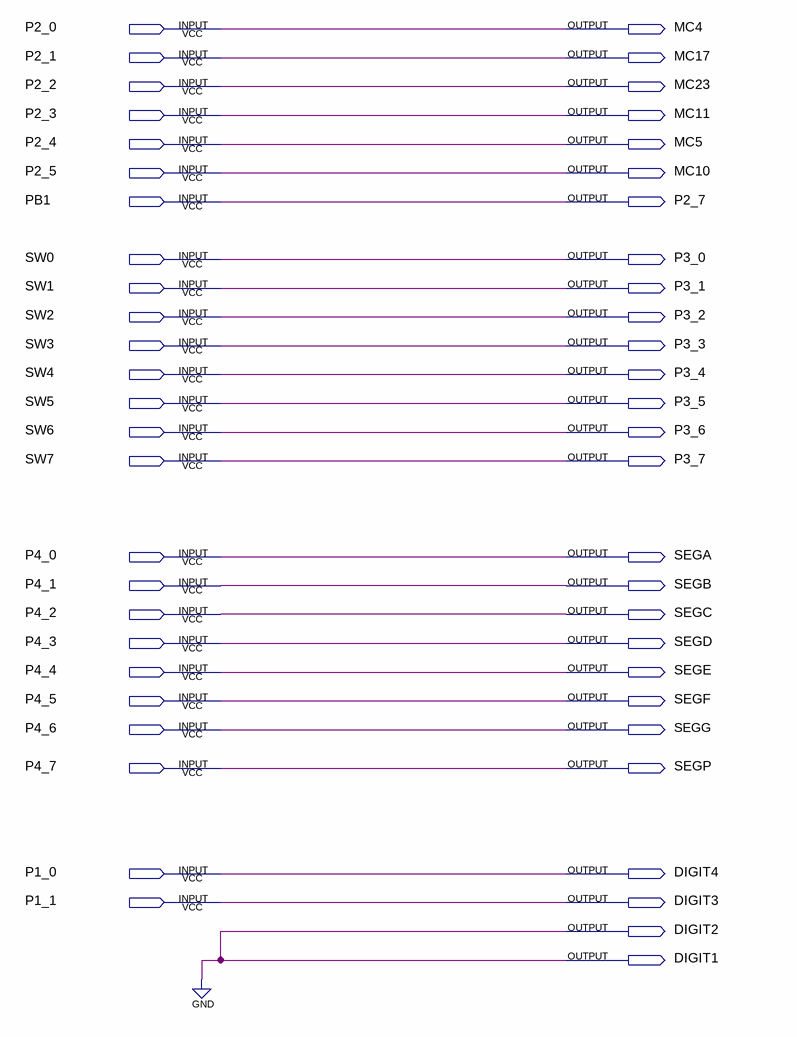
[diagram p0: schematic sheet]
// Quartus schematic ece315_top.bdf as structural Verilog: 0 symbols, 52 pins
module ece315_top (
  input  P2_0,
  input  P2_1,
  input  P2_2,
  input  P2_3,
  input  P2_4,
  input  P2_5,
  input  PB1,
  input  SW0,
  input  SW1,
  input  SW2,
  input  SW3,
  input  SW4,
  input  SW5,
  input  SW6,
  input  SW7,
  input  P4_0,
  input  P4_1,
  input  P4_2,
  input  P4_3,
  input  P4_4,
  input  P4_5,
  input  P4_6,
  input  P4_7,
  input  P1_0,
  input  P1_1,
  output MC4,
  output MC17,
  output MC23,
  output MC11,
  output MC5,
  output MC10,
  output P2_7,
  output P3_0,
  output P3_1,
  output P3_2,
  output P3_3,
  output P3_4,
  output P3_5,
  output P3_6,
  output P3_7,
  output SEGA,
  output SEGB,
  output SEGC,
  output SEGD,
  output SEGE,
  output SEGF,
  output SEGG,
  output SEGP,
  output DIGIT4,
  output DIGIT3,
  output DIGIT2,
  output DIGIT1
);


  assign DIGIT1 = 1'b0;
  assign DIGIT2 = 1'b0;
  assign DIGIT3 = P1_1;
  assign DIGIT4 = P1_0;
  assign MC4 = P2_0;
  assign MC5 = P2_4;
  assign MC10 = P2_5;
  assign MC11 = P2_3;
  assign MC17 = P2_1;
  assign MC23 = P2_2;
  assign P2_7 = PB1;
  assign P3_0 = SW0;
  assign P3_1 = SW1;
  assign P3_2 = SW2;
  assign P3_3 = SW3;
  assign P3_4 = SW4;
  assign P3_5 = SW5;
  assign P3_6 = SW6;
  assign P3_7 = SW7;
  assign SEGA = P4_0;
  assign SEGB = P4_1;
  assign SEGC = P4_2;
  assign SEGD = P4_3;
  assign SEGE = P4_4;
  assign SEGF = P4_5;
  assign SEGG = P4_6;
  assign SEGP = P4_7;
endmodule
